# EAGLE design EmergencySwitch (EAGLE 6.1)
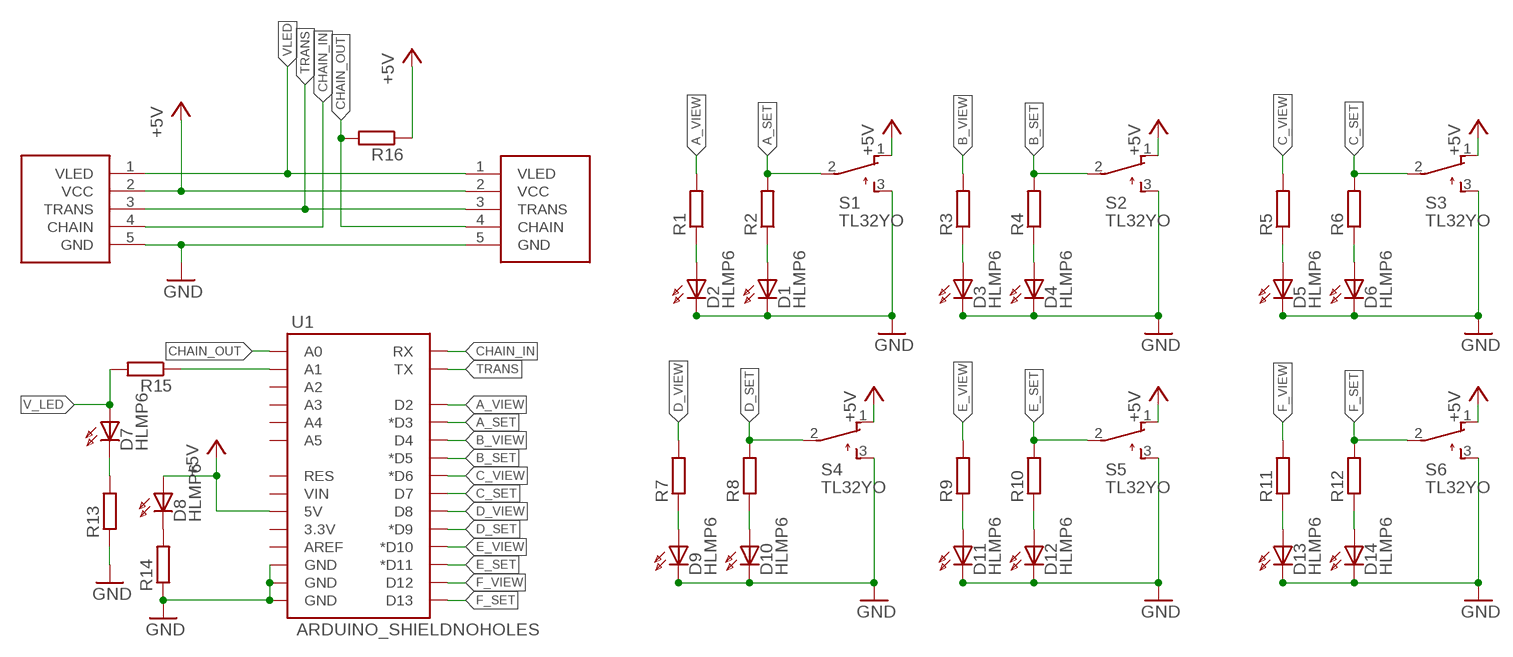
[diagram p0: schematic, sheet 1]

## Parts
CONN_IN  SERIAL_SENSORXH  [XH-5]
CONN_OUT  SERIAL_SENSORXH  [XH-5]
D1  HLMP6  [HLMP6]
D2  HLMP6  [HLMP6]
D3  HLMP6  [HLMP6]
D4  HLMP6  [HLMP6]
D5  HLMP6  [HLMP6]
D6  HLMP6  [HLMP6]
D7  HLMP6  [HLMP6]
D8  HLMP6  [HLMP6]
D9  HLMP6  [HLMP6]
D10  HLMP6  [HLMP6]
D11  HLMP6  [HLMP6]
D12  HLMP6  [HLMP6]
D13  HLMP6  [HLMP6]
D14  HLMP6  [HLMP6]
R1  R-EU_R0603  [R0603]
R2  R-EU_R0603  [R0603]
R3  R-EU_R0603  [R0603]
R4  R-EU_R0603  [R0603]
R5  R-EU_R0603  [R0603]
R6  R-EU_R0603  [R0603]
R7  R-EU_R0603  [R0603]
R8  R-EU_R0603  [R0603]
R9  R-EU_R0603  [R0603]
R10  R-EU_R0603  [R0603]
R11  R-EU_R0603  [R0603]
R12  R-EU_R0603  [R0603]
R13  R-EU_R0603  [R0603]
R14  R-EU_R0603  [R0603]
R15  R-EU_R0603  [R0603]
R16  R-EU_R0603  [R0603]
S1  TL32YO  [TL3XYO]
S2  TL32YO  [TL3XYO]
S3  TL32YO  [TL3XYO]
S4  TL32YO  [TL3XYO]
S5  TL32YO  [TL3XYO]
S6  TL32YO  [TL3XYO]
U1  ARDUINO_SHIELDNOHOLES  [DUEMILANOVE_SHIELD_NOHOLES]

## Nets
+5V: CONN_IN.2(VCC) CONN_OUT.2(VCC) D8.A R16.1 S1.1(O) S2.1(O) S3.1(O) S4.1(O) S5.1(O) S6.1(O) U1.5V
A_SET: R2.2 S1.2(P) U1.D3(*D3)
A_VIEW: R1.2 U1.D2
B_SET: R4.2 S2.2(P) U1.D5(*D5)
B_VIEW: R3.2 U1.D4
C_SET: R6.2 S3.2(P) U1.D7
C_VIEW: R5.2 U1.D6(*D6)
CHAIN_IN: CONN_IN.4(CHAIN) U1.RX
CHAIN_OUT: CONN_OUT.4(CHAIN) R16.2 U1.A0
D_SET: R8.2 S4.2(P) U1.D9(*D9)
D_VIEW: R7.2 U1.D8
E_SET: R10.2 S5.2(P) U1.D11(*D11)
E_VIEW: R9.2 U1.D10(*D10)
F_SET: R12.2 S6.2(P) U1.D13
F_VIEW: R11.2 U1.D12
GND: CONN_IN.5(GND) CONN_OUT.5(GND) D1.K D2.K D3.K D4.K D5.K D6.K D9.K D10.K D11.K D12.K D13.K D14.K R13.1 R14.1 S1.3(S) S2.3(S) S3.3(S) S4.3(S) S5.3(S) S6.3(S) U1.GND@0(GND) U1.GND@1(GND) U1.GND@2(GND)
N$1: D7.K R13.2
N$2: D8.K R14.2
N$3: D1.A R2.1
N$4: D4.A R4.1
N$5: D3.A R3.1
N$6: D6.A R6.1
N$7: D2.A R1.1
N$8: D5.A R5.1
N$9: D10.A R8.1
N$10: D9.A R7.1
N$11: D12.A R10.1
N$12: D11.A R9.1
N$13: D14.A R12.1
N$14: D13.A R11.1
N$15: R15.1 U1.A1
TRANS: CONN_IN.3(TRANS) CONN_OUT.3(TRANS) U1.TX
V_LED: D7.A R15.2
VLED: CONN_IN.1(VLED) CONN_OUT.1(VLED)
Unconnected: U1.3.3V U1.A2 U1.A3 U1.A4 U1.A5 U1.AREF U1.RES U1.VIN

## Library data of the parts
CONN_IN CONN_OUT = myparts:SERIAL_SENSOR
D1-D14 = display-hp:HLMP6: LED 2mm horizontal; MF: AGILENT TECHNOLOGIES; MPN: HLMP-6500; OC_FARNELL: 1652490; OC_NEWARK: 40K0088
R1-R16 = resistor:R-EU_: RESISTOR, European symbol
S1-S6 = switch:TL32YO: TINY SWITCH ON - MOM Source: http://www2.produktinfo.conrad.com/datenblaetter/700000-724999/705152-da-01-de-Subminiaturschalter_TL_36YO.pdf
U1 = SparkFun:ARDUINO_SHIELD

## Net classes
0 default: width 0.406 mm

## Board
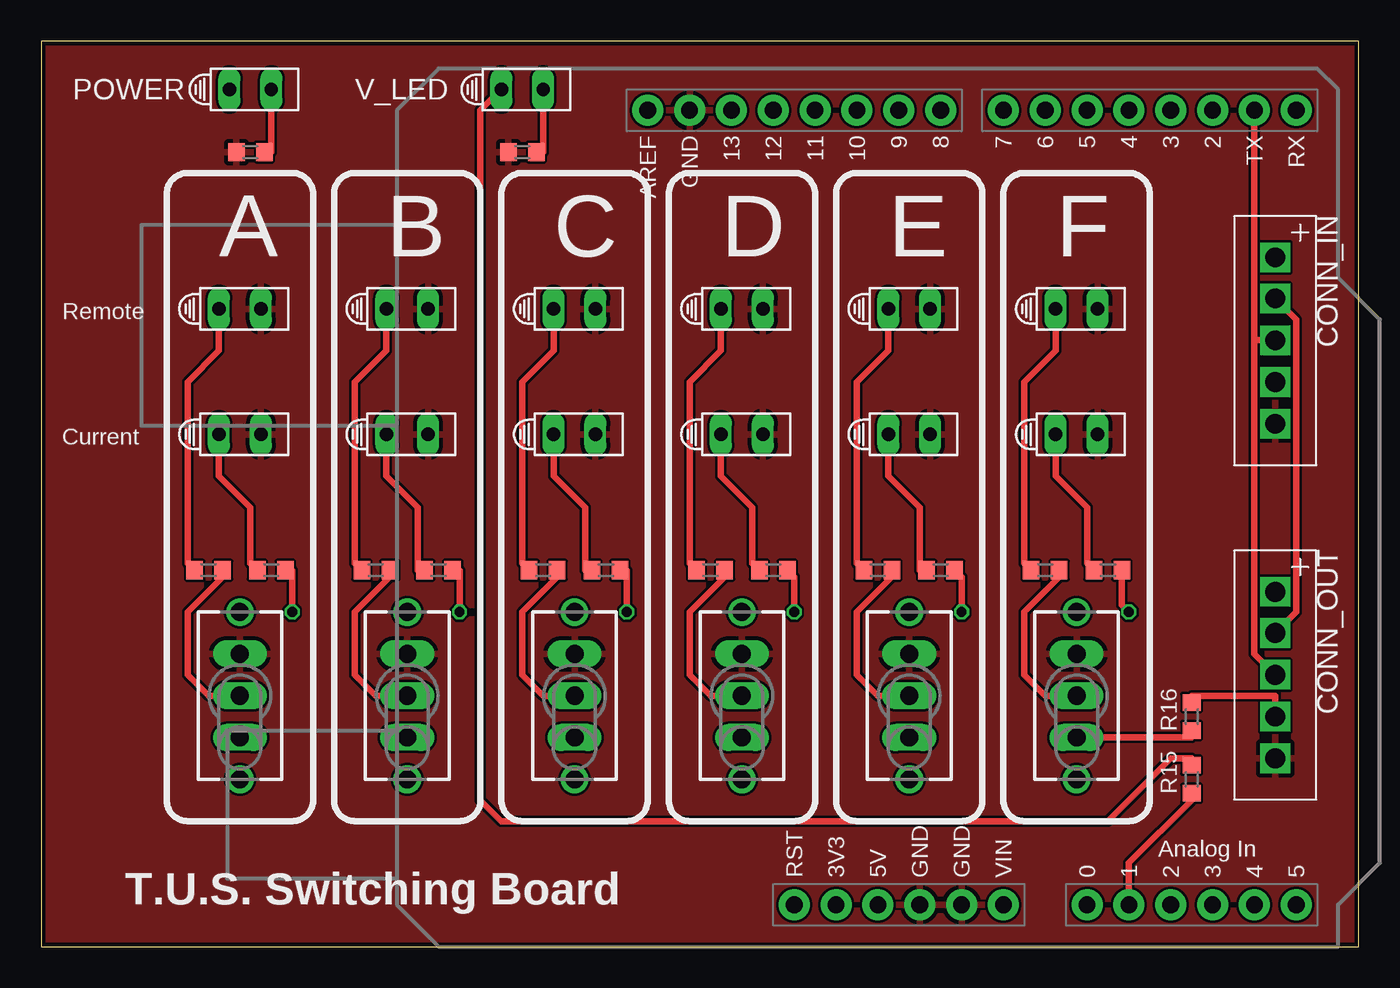
[diagram p1: board, top side]
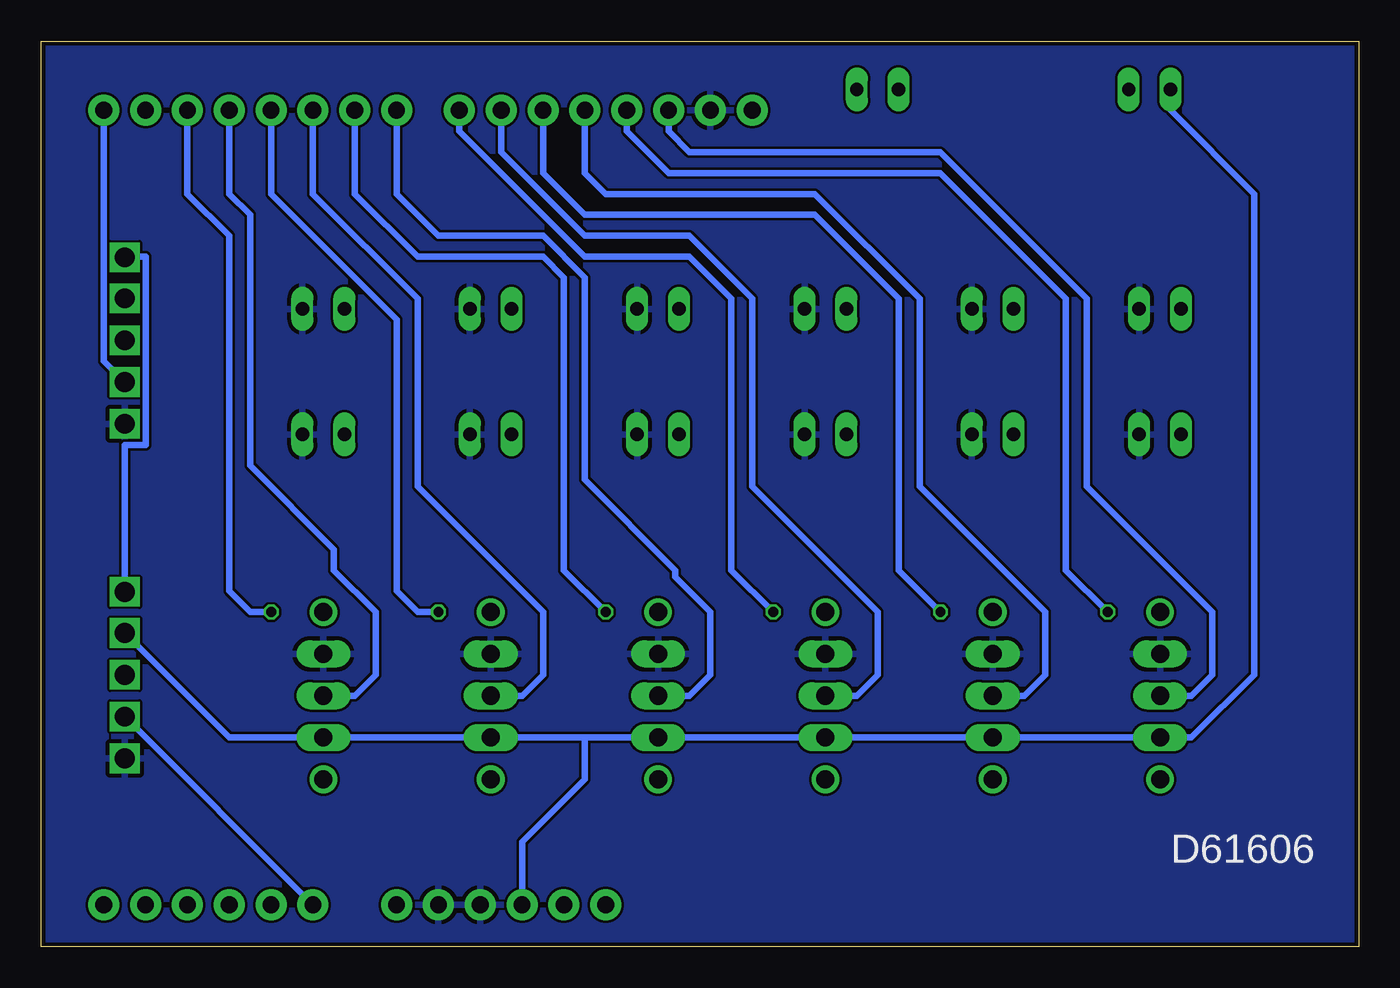
[diagram p2: board, bottom side, seen from below]

Size 80 x 55 mm. Coordinates in mm from the lower left corner, seen from the top.
Outline: 0,0 80,0 80,55 0,55 0,0
Copper layers (1*16): Top 0.035mm / dielectric 1.5mm / Bottom 0.035mm
Design rules: minimum track width 6mil, minimum drill 12mil, track to track 6mil, track to pad 6mil, pad to pad 6mil, via to via 6mil, smd to smd 0mil, copper to edge 10mil, drill to drill 10mil, minimum pad ring 10mil, minimum via ring 6mil, stop-mask expansion 2mil, vias tented up to drill 100mil, thermal gap 10mil

### Footprints (pad centres in the part's own frame; a part is rotated, then mirrored left to right if it is on the bottom)
XH-5 = drill 1.2 square: 1 -5.04,0; 2 -2.54,0; 3 0,0; 4 2.54,0; 5 5.08,0
HLMP6 = drill 0.813 long: A -1.27,0; K 1.27,0
R0603 = smd 1 x 1.1: 1 -0.85,0; 2 0.85,0
TL3XYO = drill 1.1 pad 1.422 long: 1 -2.54,0; 2 0,0; 3 2.54,0 | drill 1.1 pad 1.676: M1 -5.08,0; M2 5.08,0
DUEMILANOVE_SHIELD_NOHOLES = drill 1.016 pad 1.88: 3.3V 50.8,26.67; 5V 50.8,29.21; A0 50.8,41.91; A1 50.8,44.45; A2 50.8,46.99; A3 50.8,49.53; A4 50.8,52.07; A5 50.8,54.61; AREF 2.54,15.24; D2 2.54,49.53; D3 2.54,46.99; D4 2.54,44.45; D5 2.54,41.91; D6 2.54,39.37; D7 2.54,36.83; D8 2.54,33.02; D9 2.54,30.48; D10 2.54,27.94; D11 2.54,25.4; D12 2.54,22.86; D13 2.54,20.32; GND@0 50.8,31.75; GND@1 50.8,34.29; GND@2 2.54,17.78; RES 50.8,24.13; RX 2.54,54.61; TX 2.54,52.07; VIN 50.8,36.83

### Placement (x,y rotation side)
CONN_IN  74.93,36.83 270 top
CONN_OUT  74.93,16.51 270 top
D1  62.87,38.73 0 top
D2  62.87,31.11 0 top
D3  52.7,31.11 0 top
D4  52.7,38.73 0 top
D5  42.55,31.11 0 top
D6  42.55,38.73 0 top
D7  29.21,52.07 0 top
D8  12.7,52.07 0 top
D9  32.38,31.11 0 top
D10  32.38,38.73 0 top
D11  22.23,31.11 0 top
D12  22.23,38.73 0 top
D13  12.06,31.11 0 top
D14  12.06,38.73 0 top
R1  64.77,22.86 0 top
R2  60.96,22.86 0 top
R3  54.61,22.86 0 top
R4  50.8,22.86 0 top
R5  44.45,22.86 0 top
R6  40.64,22.86 0 top
R7  34.29,22.86 0 top
R8  30.48,22.86 0 top
R9  24.13,22.86 0 top
R10  20.32,22.86 0 top
R11  13.97,22.86 0 top
R12  10.16,22.86 0 top
R13  29.21,48.26 0 top
R14  12.7,48.26 0 top
R15  69.85,10.16 90 top
R16  69.85,13.97 90 top
S1  62.87,15.24 90 top
S2  52.7,15.24 90 top
S3  42.55,15.24 90 top
S4  32.38,15.24 90 top
S5  22.23,15.24 90 top
S6  12.06,15.24 90 top
U1  21.59,53.34 270 top

### Tracks (layer width: path | path; a pad name or v marks a point on that pad's centre or on a via)
+5V
  Top 0.406: S1.1 69.85,12.7 R16.1 | CONN_IN.2 76.2,38.1 76.2,20.32 CONN_OUT.2
  Bottom 0.406: 46.99,12.7 S3.1 S4.1 S5.1 S6.1 10.16,12.7 6.35,16.51 6.35,45.72 11.43,50.8 D8.A | 46.99,12.7 S2.1 S1.1 68.58,12.7 CONN_OUT.2 | U1.5V 50.8,6.35 46.99,10.16 46.99,12.7
A_SET
  Top 0.406: R2.2 61.81,22.44 59.69,20.32 59.69,16.51 60.96,15.24 S1.2
  Bottom 0.406: U1.D3 68.58,45.72 67.31,44.45 67.31,29.21 62.23,24.13 62.23,22.86 59.69,20.32 59.69,16.51 60.96,15.24 S1.2 63.5,15.24
A_VIEW  (via drill 0.6)
  Top 0.406: R1.2 65.62,20.74 v66.04,20.32
  Bottom 0.406: U1.D2 71.12,45.72 68.58,43.18 68.58,21.59 67.31,20.32 v66.04,20.32
B_SET
  Top 0.406: R4.2 51.65,22.44 49.53,20.32 49.53,16.51 50.8,15.24 S2.2
  Bottom 0.406: U1.D5 63.5,45.72 57.15,39.37 57.15,27.94 49.53,20.32 49.53,16.51 50.8,15.24 S2.2
B_VIEW  (via drill 0.6)
  Top 0.406: v55.88,20.32 55.88,22.44 R3.2
  Bottom 0.406: U1.D4 66.04,45.72 58.42,38.1 58.42,21.59 57.15,20.32 v55.88,20.32
C_SET
  Top 0.406: R6.2 41.49,22.44 39.37,20.32 39.37,16.51 40.64,15.24 S3.2
  Bottom 0.406: U1.D7 58.42,45.72 55.88,43.18 49.53,43.18 46.99,40.64 46.99,28.36 R6.2 41.49,22.44 39.37,20.32 39.37,16.51 40.64,15.24 S3.2
C_VIEW  (via drill 0.6)
  Top 0.406: v45.72,20.32 45.72,22.44 R5.2
  Bottom 0.406: U1.D6 60.96,45.72 57.15,41.91 49.53,41.91 48.26,40.64 48.26,22.86 v45.72,20.32
CHAIN_IN
  Bottom 0.406: CONN_IN.4 76.2,35.56 U1.RX
CHAIN_OUT
  Top 0.406: CONN_OUT.4 74.93,15.24 69.85,15.24 R16.2
  Bottom 0.406: CONN_OUT.4 U1.A0
D_SET
  Top 0.406: R8.2 31.33,22.44 29.21,20.32 29.21,16.51 30.48,15.24 S4.2
  Bottom 0.406: U1.D9 52.07,48.26 46.99,43.18 40.64,43.18 36.83,39.37 36.83,27.94 29.21,20.32 29.21,16.51 30.48,15.24 S4.2
D_VIEW  (via drill 0.6)
  Top 0.406: v35.56,20.32 35.56,22.86 R7.2
  Bottom 0.406: U1.D8 54.61,49.53 46.99,41.91 40.64,41.91 38.1,39.37 38.1,22.86 v35.56,20.32
E_SET
  Top 0.406: R10.2 21.17,22.44 19.05,20.32 19.05,16.51 20.32,15.24 S5.2
  Bottom 0.406: U1.D11 46.99,46.99 45.72,45.72 33.02,45.72 26.67,39.37 26.67,27.94 19.05,20.32 19.05,16.51 20.32,15.24 S5.2
E_VIEW  (via drill 0.6)
  Top 0.406: v25.4,20.32 25.4,22.86 R9.2
  Bottom 0.406: U1.D10 49.53,46.99 46.99,44.45 33.02,44.45 27.94,39.37 27.94,22.86 v25.4,20.32
F_SET
  Top 0.406: R12.2 11.01,22.44 8.89,20.32 8.89,16.51 10.16,15.24 S6.2
  Bottom 0.406: U1.D13 41.91,49.53 40.64,48.26 25.4,48.26 16.51,39.37 16.51,27.94 8.89,20.32 8.89,16.51 10.16,15.24 S6.2
F_VIEW  (via drill 0.6)
  Top 0.406: v15.24,20.32 15.24,22.86 R11.2
  Bottom 0.406: U1.D12 44.45,49.53 41.91,46.99 25.4,46.99 17.78,39.37 17.78,22.86 v15.24,20.32
GND
  pour Bottom: -2.54,58.42 -2.54,-1.27 85.09,-1.27 85.09,59.69 -2.54,59.69
  pour Top: -3.81,62.23 -5.08,62.23 -5.08,-1.27 87.63,-1.27 87.63,62.23
N$1
  Top 0.406: D7.K 30.48,48.26 R13.2
N$2
  Top 0.406: D8.K 13.97,48.26 R14.2
N$3
  Top 0.406: D1.A 61.59,36.2 59.69,34.29 59.69,23.28 R2.1
N$4
  Top 0.406: D4.A 51.44,36.2 49.53,34.29 49.53,23.28 R4.1
N$5
  Top 0.406: D3.A 51.44,28.57 53.34,26.67 53.34,22.86 R3.1
N$6
  Top 0.406: D6.A 41.27,36.2 39.37,34.29 39.37,23.28 R6.1
N$7
  Top 0.406: D2.A 61.59,28.57 63.5,26.67 63.5,23.28 R1.1
N$8
  Top 0.406: D5.A 41.27,28.57 43.18,26.67 43.18,23.28 R5.1
N$9
  Top 0.406: D10.A 31.11,36.2 29.21,34.29 29.21,23.28 R8.1
N$10
  Top 0.406: D9.A 31.11,28.57 33.02,26.67 33.02,22.86 R7.1
N$11
  Top 0.406: D12.A 20.95,36.2 19.05,34.29 19.05,23.28 R10.1
N$12
  Top 0.406: D11.A 20.95,28.57 22.86,26.67 22.86,22.86 R9.1
N$13
  Top 0.406: D14.A 10.79,36.2 8.89,34.29 8.89,23.28 R12.1
N$14
  Top 0.406: D13.A 10.79,28.57 12.7,26.67 12.7,23.28 R11.1
N$15
  Top 0.406: U1.A1 66.04,5.08 69.85,8.89 R15.1
TRANS
  Top 0.406: CONN_OUT.3 73.66,17.78 73.66,36.83 | U1.TX 73.66,36.83 | 73.66,36.83 CONN_IN.3
V_LED
  Top 0.406: D7.A 26.67,50.8 26.67,8.89 27.94,7.62 64.77,7.62 68.58,11.43 69.85,11.43 R15.2
VLED
  Bottom 0.406: CONN_OUT.1 74.93,30.48 73.66,30.48 73.66,41.91 74.93,41.91 CONN_IN.1

### Text on the board
tPlace: POWER | V_LED | A | B | C | D | E | F | T.U.S. Switching Board
bPlace: D61606
tNames: Remote | Current